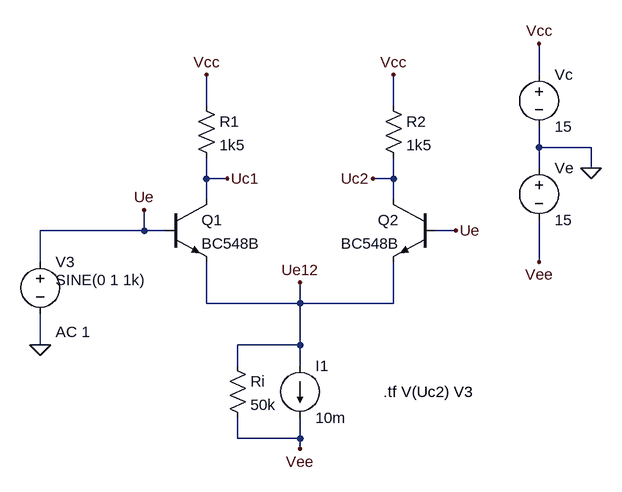
[diagram p0: schematic tf.asc]
tf.asc, the LTspice schematic file:
Version 4
SHEET 1 880 680
WIRE 496 -80 496 -128
WIRE -16 -32 -16 -80
WIRE 272 -32 272 -80
WIRE 496 32 496 0
WIRE 576 32 496 32
WIRE 496 64 496 32
WIRE 576 64 576 32
WIRE -16 80 -16 48
WIRE 16 80 -16 80
WIRE 272 80 272 48
WIRE 272 80 240 80
WIRE -16 112 -16 80
WIRE 272 112 272 80
WIRE -112 160 -112 128
WIRE -112 160 -272 160
WIRE -80 160 -112 160
WIRE 368 160 336 160
WIRE -272 208 -272 160
WIRE 496 208 496 144
WIRE -16 272 -16 208
WIRE 128 272 128 240
WIRE 128 272 -16 272
WIRE 272 272 272 208
WIRE 272 272 128 272
WIRE -272 336 -272 288
WIRE 128 336 128 272
WIRE 128 336 32 336
WIRE 32 368 32 336
WIRE 128 368 128 336
WIRE 32 480 32 448
WIRE 128 480 128 448
WIRE 128 480 32 480
WIRE 128 496 128 480
FLAG 128 496 Vee
FLAG 576 64 0
FLAG 496 -128 Vcc
FLAG 496 208 Vee
FLAG -16 -80 Vcc
FLAG 272 -80 Vcc
FLAG -272 336 0
FLAG 16 80 Uc1
FLAG 240 80 Uc2
FLAG 128 240 Ue12
FLAG -112 128 Ue
FLAG 368 160 Ue
SYMBOL npn -80 112 R0
SYMATTR InstName Q1
SYMATTR Value BC548B
SYMBOL npn 336 112 M0
SYMATTR InstName Q2
SYMATTR Value BC548B
SYMBOL current 128 368 R0
WINDOW 123 0 0 Left 2
WINDOW 39 0 0 Left 2
SYMATTR InstName I1
SYMATTR Value 10m
SYMBOL res -32 -48 R0
SYMATTR InstName R1
SYMATTR Value 1k5
SYMBOL res 256 -48 R0
SYMATTR InstName R2
SYMATTR Value 1k5
SYMBOL voltage 496 -96 R0
WINDOW 123 0 0 Left 2
WINDOW 39 0 0 Left 2
SYMATTR InstName Vc
SYMATTR Value 15
SYMBOL voltage 496 48 R0
WINDOW 123 0 0 Left 2
WINDOW 39 0 0 Left 2
SYMATTR InstName Ve
SYMATTR Value 15
SYMBOL voltage -272 192 R0
WINDOW 123 24 124 Left 2
WINDOW 3 24 44 Left 2
WINDOW 39 0 0 Left 2
SYMATTR Value2 AC 1
SYMATTR Value SINE(0 1 1k)
SYMATTR InstName V3
SYMBOL res 16 352 R0
SYMATTR InstName Ri
SYMATTR Value 50k
TEXT 256 408 Left 2 !.tf V(Uc2) V3

The netlist it stands for:
* tf.asc
Q1 Uc1 Ue Ue12 0 BC548B
Q2 Uc2 Ue Ue12 0 BC548B
I1 Ue12 Vee 10m
R1 Vcc Uc1 1k5
R2 Vcc Uc2 1k5
Vc Vcc 0 15
Ve 0 Vee 15
V3 Ue 0 SINE(0 1 1k) AC 1
Ri Ue12 Vee 50k
.model NPN NPN
.model PNP PNP
.lib standard.bjt
.tf V(Uc2) V3
.backanno
.end